# EAGLE design Adafruit 1.54in eInk Breakout with EYESPI (EAGLE 9.6.2)
COMPANY: ADAFRUIT INDUSTRIES; DRAWN: K. TOWNSEND; REV: A
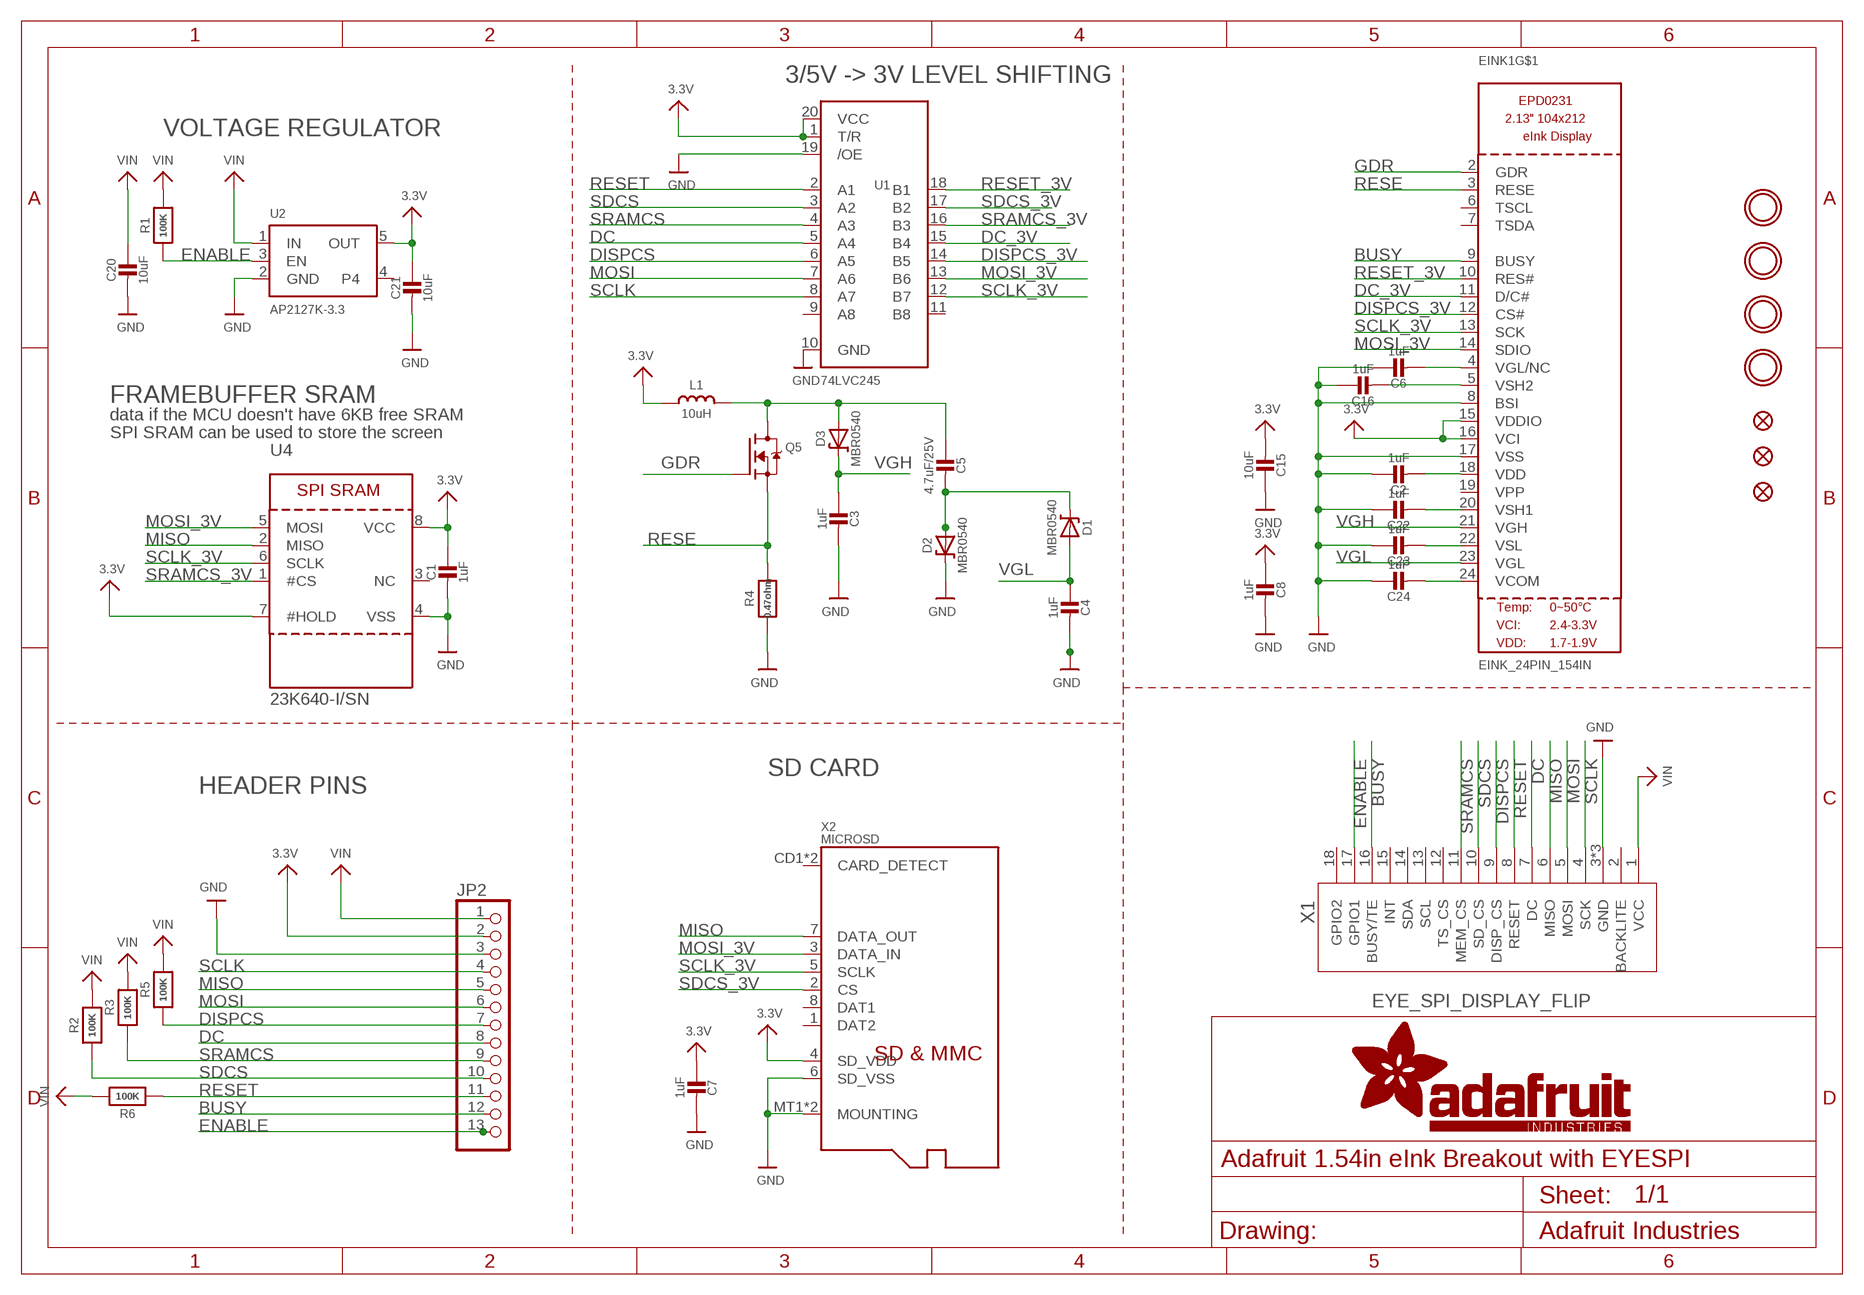
[diagram p0: schematic, sheet 1]

## Parts
C1  1uF  CAP_CERAMIC0805-NOOUTLINE  [0805-NO]
C2  1uF  CAP_CERAMIC0805-NOOUTLINE  [0805-NO]
C3  1uF  CAP_CERAMIC0805-NOOUTLINE  [0805-NO]
C4  1uF  CAP_CERAMIC0805-NOOUTLINE  [0805-NO]
C5  4.7uF/25V  CAP_CERAMIC0805-NOOUTLINE  [0805-NO]
C6  1uF  CAP_CERAMIC0805-NOOUTLINE  [0805-NO]
C7  1uF  CAP_CERAMIC0805-NOOUTLINE  [0805-NO]
C8  1uF  CAP_CERAMIC0805-NOOUTLINE  [0805-NO]
C15  10uF  CAP_CERAMIC0805-NOOUTLINE  [0805-NO]
C16  1uF  CAP_CERAMIC0805-NOOUTLINE  [0805-NO]
C20  10uF  CAP_CERAMIC0805-NOOUTLINE  [0805-NO]
C21  10uF  CAP_CERAMIC0805-NOOUTLINE  [0805-NO]
C22  1uF  CAP_CERAMIC0805-NOOUTLINE  [0805-NO]
C23  1uF  CAP_CERAMIC0805-NOOUTLINE  [0805-NO]
C24  1uF  CAP_CERAMIC0805-NOOUTLINE  [0805-NO]
D1  MBR0540  DIODE-SCHOTTKYSOD-123  [SOD-123]
D2  MBR0540  DIODE-SCHOTTKYSOD-123  [SOD-123]
D3  MBR0540  DIODE-SCHOTTKYSOD-123  [SOD-123]
EINK1  EINK_24PIN_154IN  [EINK_154IN]
FID1  FIDUCIAL_1MM  [FIDUCIAL_1MM]
FID2  FIDUCIAL_1MM  [FIDUCIAL_1MM]
FID3  FIDUCIAL_1MM  [FIDUCIAL_1MM]
JP2  HEADER-1X13  [1X13_ROUND_70]
L1  10uH  INDUCTORNR401  [INDUCTOR_4X4MM_NR401]
Q5  IRLML0100  IRLML2060TRPBF  [SOT23-3]
R1  100K  RESISTOR0805_NOOUTLINE  [0805-NO]
R2  100K  RESISTOR0805_NOOUTLINE  [0805-NO]
R3  100K  RESISTOR0805_NOOUTLINE  [0805-NO]
R4  0.47ohm  RESISTOR0805_10MGAP  [0805_10MGAP]
R5  100K  RESISTOR0805_NOOUTLINE  [0805-NO]
R6  100K  RESISTOR0805_NOOUTLINE  [0805-NO]
U1  74LVC245  74LCX245_TSSOP20  [TSSOP20]
U2  AP2127K-3.3  VREG_SOT23-5  [SOT23-5]
U4  23K640-I/SN  SRAM_SPI_SOIC8  [SOIC8_150MIL]
U$3  MOUNTINGHOLE2.5  [MOUNTINGHOLE_2.5_PLATED]
U$4  MOUNTINGHOLE2.5  [MOUNTINGHOLE_2.5_PLATED]
U$5  MOUNTINGHOLE2.5  [MOUNTINGHOLE_2.5_PLATED]
U$6  MOUNTINGHOLE2.5  [MOUNTINGHOLE_2.5_PLATED]
X1  EYE_SPI_DISPLAY_FLIP  [EYE_SPI_DISPLAY_BOTCONTACT]
X2  MICROSD  [MICROSD]

## Nets
3.3V: C1.1 C7.1 C8.1 C15.2 C21.1 EINK1.15(VDDIO) EINK1.16(VCI) JP2.2 L1.P$2 U1.1(T/R) U1.20(VCC) U2.5(OUT) U4.7(#HOLD) U4.8(VCC) X2.4(SD_VDD)
BUSY: EINK1.9(BUSY) JP2.12 X1.16(BUSY/TE)
DC: JP2.8 U1.5(A4) X1.7(DC)
DC_3V: EINK1.11(D/C#) U1.15(B4)
DISPCS: JP2.7 R5.1 U1.6(A5) X1.9(DISP_CS)
DISPCS_3V: EINK1.12(CS#) U1.14(B5)
ENABLE: JP2.13 R1.1 U2.3(EN) X1.17(GPIO1)
GDR: EINK1.2(GDR) Q5.1(G)
GND: C1.2 C2.1 C3.2 C4.2 C6.1 C7.2 C8.2 C15.1 C16.1 C20.2 C21.2 C22.1 C23.1 C24.1 D2.C EINK1.8(BSI) EINK1.17(VSS) JP2.3 R4.2 U1.10(GND) U1.19(/OE) U2.2(GND) U4.4(VSS) X1.3(GND) X1.SUPPORT1(GND) X1.SUPPORT2(GND) X2.6(SD_VSS) X2.MT1(MOUNTING) X2.MT2(MOUNTING)
MISO: JP2.5 U4.2(MISO) X1.6(MISO) X2.7(DATA_OUT)
MOSI: JP2.6 U1.7(A6) X1.5(MOSI)
MOSI_3V: EINK1.14(SDIO) U1.13(B6) U4.5(MOSI) X2.3(DATA_IN)
N$2: C5.2 D1.C D2.A
N$3: C5.1 D3.A L1.P$1 Q5.3(D)
N$4: C16.2 EINK1.5(VSH2)
N$5: C2.2 EINK1.18(VDD)
N$6: C22.2 EINK1.20(VSH1)
N$9: C6.2 EINK1.4(VGL/NC)
N$27: C23.2 EINK1.22(VSL)
N$33: C24.2 EINK1.24(VCOM)
RESE: EINK1.3(RESE) Q5.2(S) R4.1
RESET: JP2.11 R6.1 U1.2(A1) X1.8(RESET)
RESET_3V: EINK1.10(RES#) U1.18(B1)
SCLK: JP2.4 U1.8(A7) X1.4(SCK)
SCLK_3V: EINK1.13(SCK) U1.12(B7) U4.6(SCLK) X2.5(SCLK)
SDCS: JP2.10 R2.1 U1.3(A2) X1.10(SD_CS)
SDCS_3V: U1.17(B2) X2.2(CS)
SRAMCS: JP2.9 R3.1 U1.4(A3) X1.11(MEM_CS)
SRAMCS_3V: U1.16(B3) U4.1(#CS)
VGH: C3.1 D3.C EINK1.21(VGH)
VGL: C4.1 D1.A EINK1.23(VGL)
VIN: C20.1 JP2.1 R1.2 R2.2 R3.2 R5.2 R6.2 U2.1(IN) X1.1(VCC)
Unconnected: EINK1.6(TSCL) EINK1.7(TSDA) EINK1.19(VPP) EINK1.SPRT1(MT) EINK1.SPRT2(MT) U1.9(A8) U1.11(B8) U2.4 U4.3(NC) X1.2(BACKLITE) X1.12(TS_CS) X1.13(SCL) X1.14(SDA) X1.15(INT) X1.18(GPIO2) X2.1(DAT2) X2.8(DAT1) X2.CD1(CARD_DETECT) X2.CD2(CARD_DETECT)

## Notes on the sheet
- 3/5V -> 3V LEVEL SHIFTING
- VOLTAGE REGULATOR
- FRAMEBUFFER SRAM
- data if the MCU doesn't have 6KB free SRAM
- SPI SRAM can be used to store the screen
- SD CARD
- HEADER PINS

## Library data of the parts
C1-C8 C15 C16 C20-C24 = microbuilder:CAP_CERAMIC: Ceramic Capacitors For new designs, use the packages preceded by an '_' character since they are more reliable: The following footprints should be used on most boards: _0402 - Standard footprint for regular board layouts _0603 - Standard footprint for regular board layouts _0805 - Standard footprint for regular board layouts _1206 - Standard footprint for regular board layouts For extremely tight-pitch boards where space is at a premium, the following 'micro-pitch' footprints can be used (smaller pads, no silkscreen outline, etc.): _0402MP - Micro-pitch footprint for very dense/compact boards _0603MP - Micro-pitch footprint for very dense/compact boards _0805MP - Micro-pitch footprint for very dense/compact boards _1206MP - Micro-pitch footprint for very dense/compact boards
D1-D3 = microbuilder:DIODE-SCHOTTKY
EINK1 = adafruit_display:EINK_24PIN
FID1-FID3 = microbuilder:FIDUCIAL: Fiducial Alignment Points Various fiducial points for machine vision alignment.; BOM: EXCLUDE
JP2 = microbuilder:HEADER-1X13
L1 = microbuilder:INDUCTOR: Inductors 0603: 10nH Ceramic Inductor - microwire antenna/RF (Digikey: 712-1434-2-ND) 0805: 560nH Ceramic Inductor - RF (Digikey: 553-1047-1-ND) 270nH Ceramic Inductor - Q = 40@250MHz, +-5%, 1 Ohm DC Resistance (Digikey: 535-10506-2-ND) 1007 (2518 Metric) SMT: 10µH 10% 250mOhm 820mA 1007 Inductor (Digikey: 587-2189-1-ND) 22µH 10% 500mOhm 580mA 1007 Inductor (Digikey: 587-2190-1-ND) 47µH 10% 950mOhm 420mA 1007 Inductor (Digikey: 587-2191-1-ND) 47µH 5% 100mOhm 1A 1008 Inductor (Digikey: 732-1816-1-ND) 5.0x5.0mm (Taiyo Yuden NR5040 Series) 6.8µH 20% 2.3A 64mOhm Inductor (Digikey: 587-2374-2-ND) 5.0x5.0mm (TDK VLC5045 Series) 4.7µH 20% 3.3A 34mOhm Inductor (Digikey: 445-6526-1-ND) 6.8µH 20% 2.7A 46mOhm Inductor (Digikey: 445-6527-1-ND) 6.0x6.0mm (TDK VLC6045 Series) 4.7µH 20% 3.8A 27mOhm Inductor (Digikey: 445-6538-2-ND) 6.8µH 20% 3A 41mOhm Inductor (Digikey: 445-6540-1-ND) 6.2µH 30% 2.2A 45mOhm Inductor (Digikey: SRR5028-6R2YCT-ND) - Not TDK VLC6045 but footprint should match 6.0x6.0mm (TDK SLF6045 Series) 6.8uH 30% 2A 33mOhm Inductor (Digikey: 445-4572-1-ND, Mouser: 810-SLF645T6R8N2R0PF) 6.0x6.0mm (Sumida CDRH5D28 Series) 6.2uH 30% 1.8A 45mOhm Inductor (Digikey: 308-1542-1-ND) Taiyo Yuden NR3015T2R2M - 2.2uH 20% 1.5A (Digikey: 587-1648-2-ND, Mouser: 963-NR3015T2R2M) - Used with TI TPS62172 CoilCraft RFID Transponder Coil - MA5532-AE (For use with AS3935 Lightning Sensor) Taiyo Yuden NRH2412T2R2MNGH - 2.2uH 20% 1AA (Digikey: 587-3443-1-ND) - Used with TI LM3671 Vishay IHLP 1.0uH Molded Inductor - 24mOhm DCR, 5A, +/-20%, -55°C-125°C (Digikey: 541-1319-1-ND)
Q5 = Parts:IRLML2060TRPBF
R1-R6 = microbuilder:RESISTOR: Resistors For new designs, use the packages preceded by an '_' character since they are more reliable: The following footprints should be used on most boards: _0402 - Standard footprint for regular board layouts _0603 - Standard footprint for regular board layouts _0805 - Standard footprint for regular board layouts _1206 - Standard footprint for regular board layouts For extremely tight-pitch boards where space is at a premium, the following 'micro-pitch' footprints can be used (smaller pads, no silkscreen outline, etc.): _0402MP - Micro-pitch footprint for very dense/compact boards _0603MP - Micro-pitch footprint for very dense/compact boards _0805MP - Micro-pitch footprint for very dense/compact boards _1206MP - Micro-pitch footprint for very dense/compact boards
U1 = microbuilder:74LCX245: 74LCX245MTC - 5.0V Tolerant Bi-Directional Buffer Can be used to interface 5.0V logic to 2.5 or 3.3V devices Digikey: 74LCX245MTCXTR-ND Mouser: 512-74LCX245MTCX
U2 = adafruit_power:VREG_SOT23-5: SOT23-5 Fixed Voltage Regulators Part Current Out V Out V In V Dropout θJA (°C/W) TJ (°C) Digikey Part No. ADP121 150mA 3.3V 3.4-5.5V 0.09V @ 150mA -- -- ADP121-AUJZ33R7CT-ND ADP121 150mA 3.0V 3.1-5.5V 0.09V @ 150mA -- -- ADP121-AUJZ30R7CT-ND ADP122 300mA 3.3V 3.4-5.5V 0.085V @ 300mA -- -- ADP122AUJZ-3.3-R7CT-ND ADP1712 300mA 3.3V 3.5-5.5V 0.17V @ 300mA -- -- ADP1712AUJZ-3.3-R7TR-ND AP7311 (Low Cost) 150mA 3.3V 3.5-6V 0.15V @ 150mA -- -- AP7311-33WG-7DICT-ND LD39015M18R 150mA 1.8V 1.9V-5.5V 0.08V @ 100mA -- -- 497-6977-1-ND LP2985A-33DBVR 150mA 3.3V 3.3-16V 0.28V @ 150mA 206 150 296-18479-1-ND MCP1824T-3302E/OT 300mA 3.3V 3.5V-6V 0.2V @ 300mA -- -- MCP1824T-3302E/OTCT-ND MIC5205-2.5YM5 TR 150mA 2.5V 2.7-16V 0.165V @ 150mA -- -- 576-1257-2-ND MIC5205-3.0YM5 TR 150mA 3.0V 3.2V-16V 0.165V @ 150mA -- -- 576-1258-2-ND MIC5205-3.3YM5 TR 150mA 3.3V 3.5V-16V 0.165V @ 150mA -- -- 576-1259-2-ND TPS780330220 150mA 3.3V+2.2V 3.6-5.5V 250mV Max -- -- 296-23332-1-ND TDA3663/N1,135 100mA 3.3V 3.5-45V 0.18V @ 50mA -- -- 568-5343-1-ND Max operating temp can be calculated using θJA, TJ (max junction temperature), and power in watts. Set the "Maximum Ambient Temperature" until it reaches TJ ("Max Junction Temperature"), which is the absolute limit for safe use of the regulator: Heat Sink Temperature Calculator <http://www.daycounter.com/Calculators/Heat-Sink-Temperature-Calculator.phtml> For example, With 12V source into a 3.3V LP2985 and a 30mA load, we are dissipating (12V-3.3V) * 0.03A = 0.261W. With a θJA of 206 °C/W, a TJ of 150°C, and 261mW we can safely use the chip without a heat sink up to 75°C (=147.1°C Junction Temperature).; JLC_ROTATION: 270
U4 = microbuilder:SRAM_SPI_SOIC8: SRAM - 8-Pin SPI Interface 23K640-I/SN - 8KB (64Kb), 20MHz, 2.7-3.6V 23K256-I/SN - 32KB (256Kb), 20MHz, 2.7-3.6V 23LC512-I/SN - 64KB (512Kb), 20MHz, 2.7-3.6V
U$3-U$6 = adafruit_electromech:MOUNTINGHOLE: Mounting Hole For #2 screws (0.086"/2.18mm width, 0.094"/2.4mm hole) use 2.5mm; BOM: EXCLUDE
X1 = adafruit_display:EYE_SPI_DISPLAY; LCSC: C2856802
X2 = adafruit_electromech:MICROSD: MicroSD/Transflash Card Holder with SPI pinout 3M: 2908-05WB-MG 4UConnector: 19656 Footprint courtesy: Adafruit Industries; JLC_ROTATION: 90; LCSC: C125617

## Board
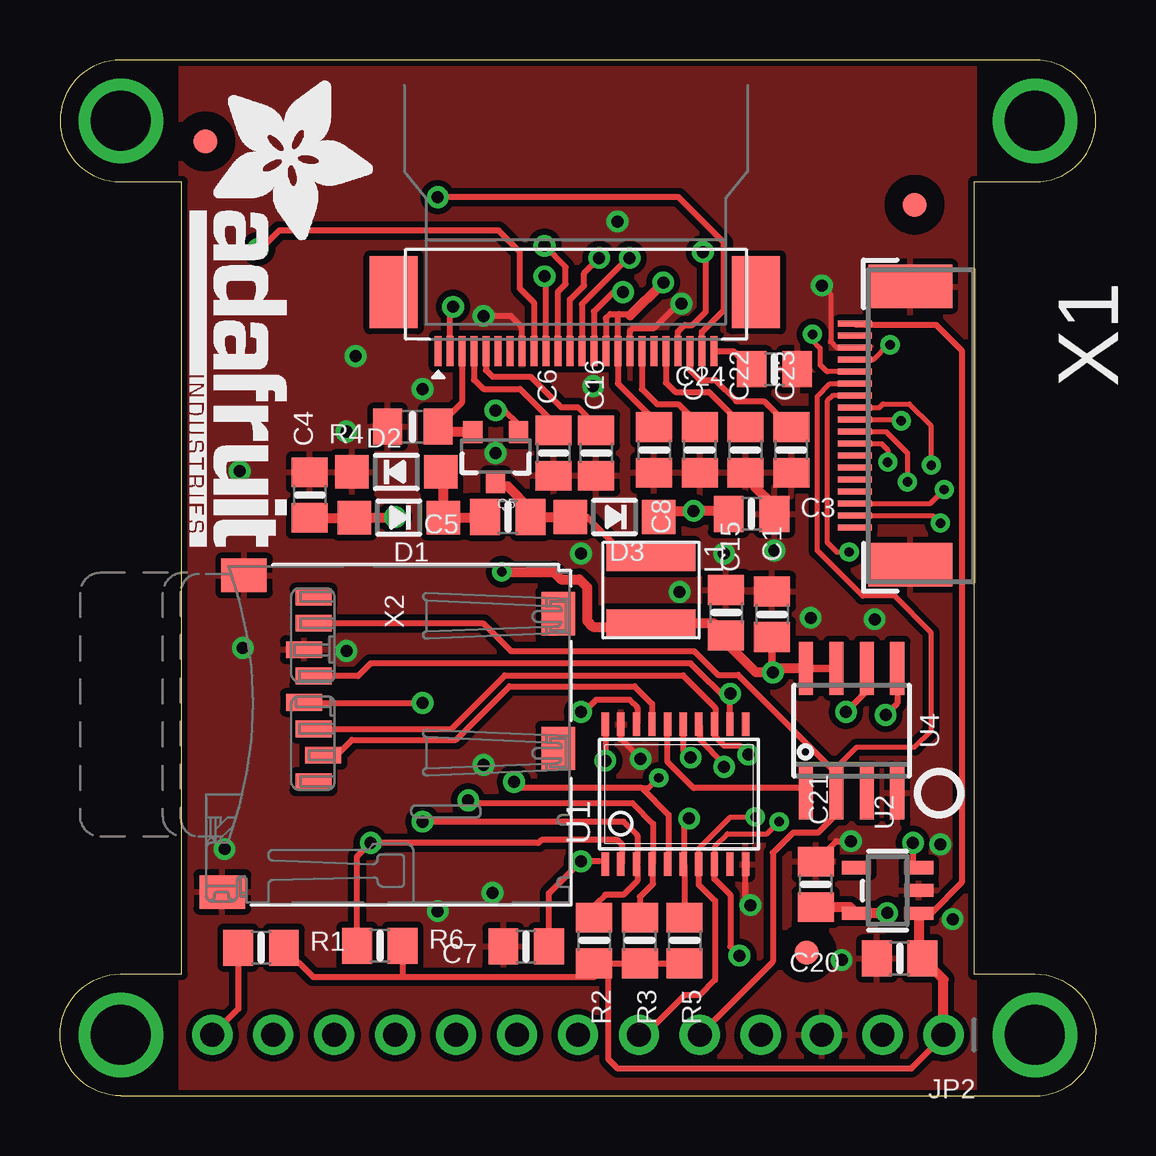
[diagram p1: board, top side]
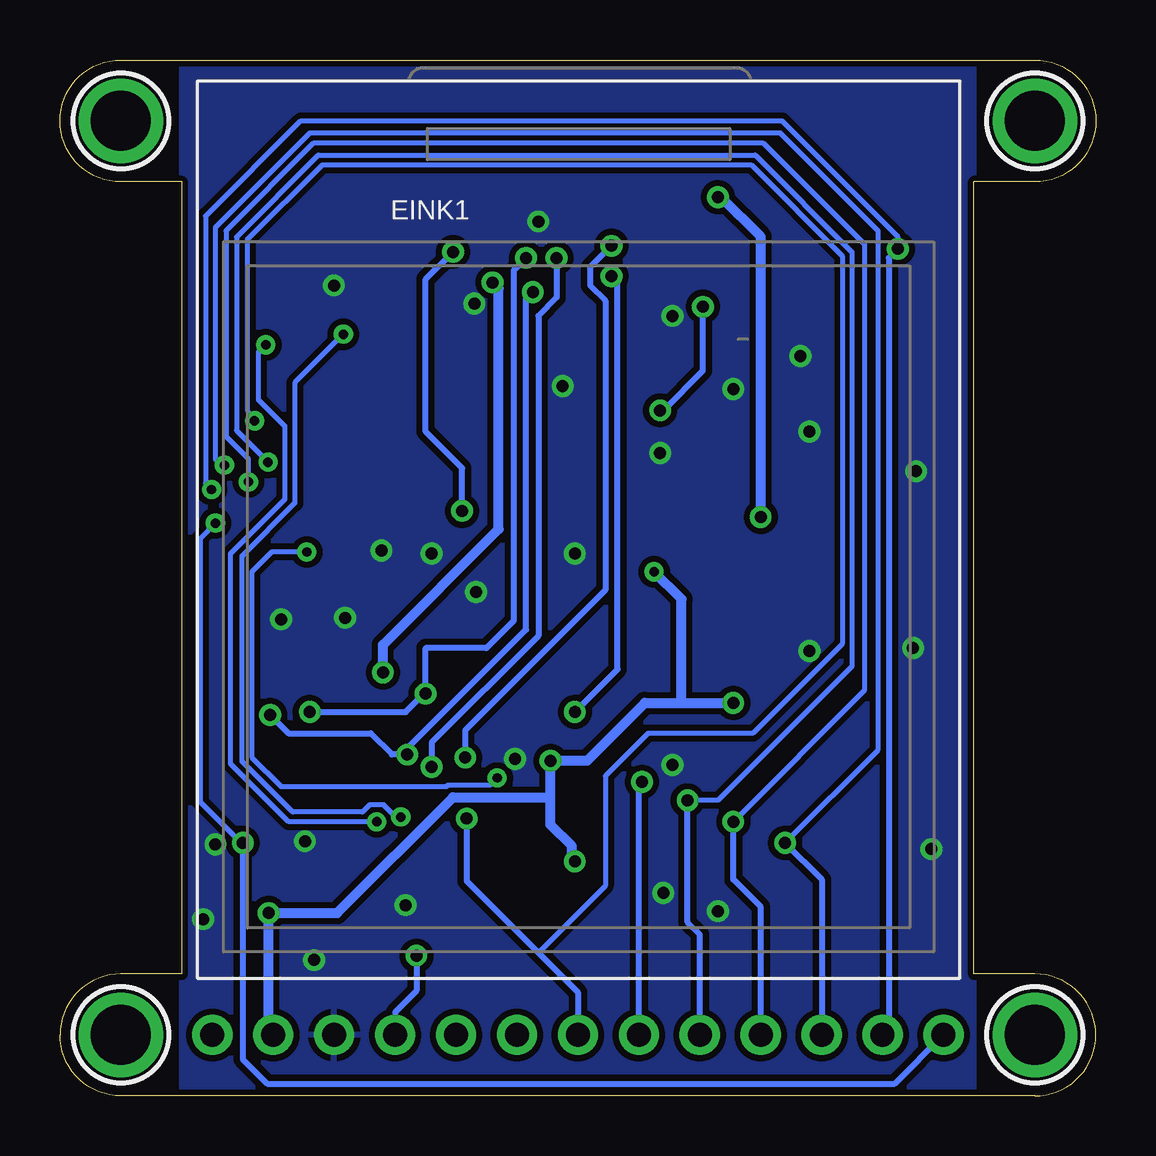
[diagram p2: board, bottom side, seen from below]

Size 43.18 x 43.18 mm. Coordinates in mm from the lower left corner, seen from the top.
Outline: 2.54,0 40.64,0 arc90 43.18,2.54 arc90 40.64,5.08 38.1,5.08 38.1,38.1 40.64,38.1 arc90 43.18,40.64 arc90 40.64,43.18 2.54,43.18 arc90 0,40.64 arc90 2.54,38.1 5.08,38.1 5.08,5.08 2.54,5.08 arc90 0,2.54 arc90 2.54,0
Copper layers (1*16): Top 0.035mm / dielectric 1.5mm / Bottom 0.035mm
Design rules "adafruit *": minimum track width 8mil, minimum drill 15.5mil, track to track 8mil, track to pad 8mil, pad to pad 8mil, via to via 8mil, smd to smd 8mil, copper to edge 10mil, drill to drill 8mil, minimum pad ring 10mil, minimum via ring 8mil, stop-mask expansion 2mil, vias tented up to drill 20mil, thermal gap 10mil

### Footprints (pad centres in the part's own frame; a part is rotated, then mirrored left to right if it is on the bottom)
0805-NO = smd 1.24 x 1.5: 1 -0.95,0; 2 0.95,0
SOD-123 = smd 1.4 x 1.4: A 1.85,0; C -1.85,0
EINK_154IN = smd 0.275 x 1.25 bottom: 1 5.75,-1.05; 2 5.25,-1.05; 3 4.75,-1.05; 4 4.25,-1.05; 5 3.75,-1.05; 6 3.25,-1.05; 7 2.75,-1.05; 8 2.25,-1.05; 9 1.75,-1.05; 10 1.25,-1.05; 11 0.75,-1.05; 12 0.25,-1.05; 13 -0.25,-1.05; 14 -0.75,-1.05; 15 -1.25,-1.05; 16 -1.75,-1.05; 17 -2.25,-1.05; 18 -2.75,-1.05; 19 -3.25,-1.05; 20 -3.75,-1.05; 21 -4.25,-1.05; 22 -4.75,-1.05; 23 -5.25,-1.05; 24 -5.75,-1.05 | smd 2 x 3 bottom: SPRT1 7.6,1.41; SPRT2 -7.51,1.41
FIDUCIAL_1MM = smd 1 x 1: 1 0,0
1X13_ROUND_70 = drill 1 pad 1.676: 1 -15.24,0; 2 -12.7,0; 3 -10.16,0; 4 -7.62,0; 5 -5.08,0; 6 -2.54,0; 7 0,0; 8 2.54,0; 9 5.08,0; 10 7.62,0; 11 10.16,0; 12 12.7,0; 13 15.24,0
INDUCTOR_4X4MM_NR401 = smd 1.2 x 3.7: P$1 -1.4,0; P$2 1.4,0
SOT23-3 = smd 0.8 x 0.9: 1 -0.95,-1; 2 0.95,-1; 3 0,1.1
0805_10MGAP = smd 1.2 x 1.5: 1 -1.05,0; 2 1.05,0
TSSOP20 = smd 0.305 x 0.991: 1 -2.925,-2.918; 2 -2.275,-2.918; 3 -1.625,-2.918; 4 -0.975,-2.918; 5 -0.325,-2.918; 6 0.325,-2.918; 7 0.975,-2.918; 8 1.625,-2.918; 9 2.275,-2.918; 10 2.925,-2.918; 11 2.925,2.918; 12 2.275,2.918; 13 1.625,2.918; 14 0.975,2.918; 15 0.325,2.918; 16 -0.325,2.918; 17 -0.975,2.918; 18 -1.625,2.918; 19 -2.275,2.918; 20 -2.925,2.918
SOT23-5 = smd 0.55 x 1.2: 1 -0.95,-1.3; 2 0,-1.3; 3 0.95,-1.3; 4 0.95,1.3; 5 -0.95,1.3
SOIC8_150MIL = smd 0.6 x 2.2: 1 -1.905,-2.6; 2 -0.635,-2.6; 3 0.635,-2.6; 4 1.905,-2.6; 5 1.905,2.6; 6 0.635,2.6; 7 -0.635,2.6; 8 -1.905,2.6
MOUNTINGHOLE_2.5_PLATED = drill 2.5 pad 3.2: P$1 0,0
EYE_SPI_DISPLAY_BOTCONTACT = smd 0.25 x 1.4: 1 4.25,1.154; 2 3.75,1.154; 3 3.25,1.154; 4 2.75,1.154; 5 2.25,1.154; 6 1.75,1.154; 7 1.25,1.154; 8 0.75,1.154; 9 0.25,1.154; 10 -0.25,1.154; 11 -0.75,1.154; 12 -1.25,1.154; 13 -1.75,1.154; 14 -2.25,1.154; 15 -2.75,1.154; 16 -3.25,1.154; 17 -3.75,1.154; 18 -4.25,1.154 | smd 1.8 x 3.5: SUPPORT1 -5.8,-1.152; SUPPORT2 5.8,-1.152
MICROSD = smd 0.7 x 1.5: 1 1.761,-3.147; 2 0.661,-2.747; 3 -0.439,-3.147; 4 -1.539,-3.547; 5 -2.639,-3.147; 6 -3.739,-3.547; 7 -4.839,-3.147; 8 -5.939,-3.147 | smd 1.8 x 1.4: CD1 -5.239,7.053; CD2 0.38,7.053 | smd 1.4 x 1.9: MT1 -6.839,-6.047; MT2 6.361,-6.947

### Placement (x,y rotation side)
C1  29.68,20.08 90 top
C2  26.67,26.92 90 top
C3  28.83,24.26 0 top
C4  10.41,25.04 90 top
C5  18.67,24.13 180 top
C6  20.57,26.8 90 top
C7  19.43,6.22 180 top
C8  24.77,26.92 270 top
C15  27.77,20.14 270 top
C16  22.35,26.8 90 top
C20  35,5.73 180 top
C21  31.51,8.81 90 top
C22  28.58,26.92 90 top
C23  30.48,26.92 90 top
C24  29.78,30.29 180 top
D1  14.12,24.1 180 top
D2  14.02,26.01 0 top
D3  23.11,24.13 180 top
EINK1  21.51,32.09 0 bottom
FID1  6.06,39.78 0 top
FID2  31.12,5.98 90 top
FID3  35.62,37.15 0 top
JP2  21.59,2.54 180 top
L1  24.64,21.08 270 top
PLABEL0  [PLABEL0]  36.83,4.19 0 top
PLABEL1  [PLABEL1]  19.05,0.89 0 top
PLABEL2  [PLABEL2]  31.75,4.19 0 top
PLABEL3  [PLABEL3]  24.13,0.89 0 top
PLABEL4  [PLABEL4]  26.67,4.19 0 top
PLABEL5  [PLABEL5]  29.21,0.89 0 top
PLABEL6  [PLABEL6]  21.59,4.19 0 top
PLABEL7  [PLABEL7]  16.51,4.19 0 top
PLABEL8  [PLABEL8]  11.43,4.19 0 top
PLABEL9  [PLABEL9]  8.89,0.89 0 top
PLABEL10  [PLABEL10]  13.97,0.89 0 top
PLABEL11  [PLABEL11]  34.29,0.89 0 top
PLABEL12  [PLABEL12]  6.35,4.19 0 top
PLABEL13  [PLABEL13]  13.34,42.86 0 top
PLABEL14  [PLABEL14]  16.26,36.07 0 top
PLABEL15  [PLABEL15]  36.83,4.19 0 bottom
PLABEL16  [PLABEL16]  34.29,0.89 0 bottom
PLABEL17  [PLABEL17]  31.75,4.19 0 bottom
PLABEL18  [PLABEL18]  24.13,0.89 0 bottom
PLABEL19  [PLABEL19]  26.67,4.19 0 bottom
PLABEL20  [PLABEL20]  29.21,0.89 0 bottom
PLABEL21  [PLABEL21]  21.59,4.19 0 bottom
PLABEL22  [PLABEL22]  16.51,4.19 0 bottom
PLABEL23  [PLABEL23]  11.43,4.19 0 bottom
PLABEL24  [PLABEL24]  8.89,0.89 0 bottom
PLABEL25  [PLABEL25]  13.97,0.89 0 bottom
PLABEL26  [PLABEL26]  19.05,0.89 0 bottom
PLABEL27  [PLABEL27]  6.35,4.19 0 bottom
Q5  18.16,26.67 180 top
R1  8.38,6.18 0 top
R2  22.27,6.48 270 top
R3  24.17,6.48 270 top
R4  14.71,27.89 180 top
R5  26.03,6.48 270 top
R6  13.34,6.26 0 top
U1  25.65,12.57 0 top
U2  34.5,8.56 90 top
U4  33,15.22 0 top
U$3  40.64,2.54 0 bottom
U$4  2.54,2.54 0 bottom
U$5  40.64,40.64 0 bottom
U$6  2.54,40.64 0 bottom
U$9  [PCBFEAT-REV-040]  36.65,12.63 0 top
U$28  [ADAFRUIT_TEXT_20MM]  5.42,42.47 270 top
X1  34.29,27.94 90 top
X2  13.72,14.86 270 top

### Tracks (layer width: path | path; a pad name or v marks a point on that pad's centre or on a via)
3.3V  (via drill 0.39, 0.5)
  Top 0.203: U1.1 22.6,9.78 22.48,9.78
  Top 0.254: EINK1.15 22.76,32.41 22.94,32.59 23.3,32.59 | 22.48,9.78 v21.72,9.78 20.38,8.44 C7.1 | v15.11,16.38 10.67,16.38 10.65,16.4 X2.4 | C8.1 24.77,28.19 23.26,29.7 EINK1.16 23.26,32.55 23.3,32.59 | U1.20 v22.73,13.97 | 23.3,32.59 23.7,32.59 23.77,32.53
  Top 0.305: U4.8 U4.7 29.68,17.82 C1.1
  Top 0.406: C21.1 32.94,7.87 U2.5 v34.48,7.62 | U4.8 29.76,17.82 29.59,17.65 v29.72,17.65 29.02,17.65 27.77,18.91 C15.2 27.27,19.68 L1.P$2 24.13,19.68 24,19.55 22.23,19.55 21.97,19.81 21.97,21.21 21.65,21.53 20.89,21.53 20.57,21.84 v18.41,21.84 | 23.77,32.53 v25.15,33.91
  Bottom 0.406: v29.72,17.65 29.72,18.8 24.89,23.62 24.89,33.66 v25.15,33.91 | 17.27,16.38 18.8,16.38 21.21,13.97 v22.73,13.97 22.73,12.45 | 17.27,16.38 v15.11,16.38 | 22.73,12.45 22.73,11.3 21.84,10.41 21.84,9.91 v21.72,9.78 | JP2.2 34.48,2.73 v34.48,7.62 31.62,7.62 26.8,12.45 22.73,12.45 | 17.27,16.38 17.27,20.7 v18.41,21.84
BUSY  (via drill 0.39, 0.5)
  Top 0.203: X1.16 36.28,24.69 v36.86,25.27
  Top 0.254: EINK1.9 19.76,33.07 19.18,33.66 19.18,35.18 18.29,36.07 9.14,36.07 8.38,35.31 v8.25,35.31
  Bottom 0.203: v36.86,25.27 37.12,25.53 37.12,36.67 33.15,40.64 13.08,40.64 8.25,35.81 v8.25,35.31
  Bottom 0.254: v8.25,35.31 8.64,34.92 8.64,2.79 JP2.12
DC  (via drill 0.39, 0.5)
  Top 0.203: X1.7 32.21,29.19 31.98,28.96 31.98,23.08 32.38,22.67 v32.89,22.67 | v24.96,13.25 24.53,12.83 24.26,12.83
  Top 0.254: v18.92,13.08 19.18,12.83 24.26,12.83 25.37,11.71 25.37,9.7 U1.5
  Bottom 0.203: v32.89,22.67 34.36,22.67 35.18,21.84 35.18,14.11 33.97,12.89 27.07,12.89 27.01,12.95 25.26,12.95 v24.96,13.25
  Bottom 0.254: JP2.8 19.05,12.95 v18.92,13.08
DC_3V  (via drill 0.5)
  Top 0.254: EINK1.11 20.76,33.52 21.08,33.85 21.08,34.54 v20.19,35.43 | U1.15 25.98,14.41 v26.29,14.1
  Bottom 0.254: v20.19,35.43 21.08,34.54 21.08,33.78 20.45,33.15 20.45,21.08 26.29,15.24 v26.29,14.1
DISPCS  (via drill 0.39, 0.5)
  Top 0.203: X1.9 35.02,28.19 v35.07,28.14
  Top 0.254: v26.23,11.56 26.02,11.35 26.02,9.7 U1.6 26.03,9.6 R5.1
  Bottom 0.203: 23.24,5.97 20.45,8.76 20.45,13.34 18.67,15.11 14.29,15.11 10.57,18.84 10.57,35.01 14.37,38.81 32.24,38.81 35.37,35.68 35.37,28.57 35.07,28.27 v35.07,28.14
  Bottom 0.254: v26.23,11.56 26.23,8.95 23.24,5.97 21.59,4.32 JP2.7
DISPCS_3V  (via drill 0.5)
  Top 0.254: v27.69,13.72 27.69,13.84 26.67,14.86 26.67,15.45 U1.14 | EINK1.12 21.26,33.2 21.84,33.78 21.84,34.29 v22.48,34.92
  Bottom 0.254: v27.69,13.72 27.69,14.73 23.24,19.18 23.24,32.51 22.48,33.27 v22.48,34.92
ENABLE  (via drill 0.39, 0.5)
  Top 0.203: X1.17 36.39,24.19 v36.7,23.88
  Top 0.254: v35.56,10.54 35.56,9.75 U2.3 | R1.1 7.43,3.62 JP2.13
  Bottom 0.203: v36.7,23.88 37.34,23.24 37.34,12.26 35.62,10.54 v35.56,10.54
  Bottom 0.254: v35.56,10.54 35.56,1.52 34.54,0.51 8.38,0.51 JP2.13
GDR  (via drill 0.5)
  Top 0.254: v16.38,32.89 16.26,32.77 EINK1.2 | Q5.1 19.11,28 18.54,28.57 v18.16,28.57
  Bottom 0.254: v16.38,32.89 16.38,30.23 18.03,28.57 v18.16,28.57
GND  (via drill 0.5)
  Top 0.203: X1.3 32.37,31.19 32.13,31.43 32.13,33.41 v31.76,33.78
  Top 0.254: EINK1.17 23.76,31.89 23.88,32 24.77,32 25.78,33.02 v25.91,33.02 | EINK1.8 19.26,32.05 18.8,32.51 v17.65,32.51 | v28.78,7.95 28.58,8.15 U1.10 | v24.21,14.05 23.38,14.87 U1.19 | C21.2 32.36,10.62 v32.97,10.62
  Top 0.406: C3.2 29.78,24.58 28.96,25.4
  other vias: 7.62,18.67 29.78,22.73 23.24,36.45 17.65,13.79 6.86,10.29 12.32,30.84 33.96,19.86 37.21,7.37 31.29,19.93 22.23,29.59 11.94,27.69 7.49,26.04 15.11,29.46 21.72,22.61 32.59,5.66 11.94,18.54 15.75,7.7 18.03,8.46 18.16,26.8 25.83,21.01 36.7,10.48 27.69,22.61
  pour Top (isolate 0.254): 5.08,43.18 38.1,43.18 38.1,0.13 5.08,0.13
  pour Bottom (isolate 0.254): 5.08,43.18 38.1,43.18 38.1,0 5.08,0
MISO
  Top 0.203: 32.36,13.55 32.36,13.7 33.21,14.54 35.62,14.54 36.32,15.24 36.32,19.3 34.8,20.83 33.46,20.83 31.57,22.72 31.57,29.16 32.1,29.69 X1.6
  Top 0.254: JP2.5 29.72,5.59 29.72,10.13 30.56,10.97 31.6,10.97 32.36,11.73 U4.2 32.36,13.55 32.27,13.55 28.26,17.55 27.42,17.55 26.43,18.54 18.8,18.54 17.65,19.68 11.3,19.68 11.29,19.7 X2.7
MOSI  (via drill 0.39)
  Top 0.203: U1.7 26.63,10.31 27.94,11.63 v28.98,11.63 | X1.5 31.98,30.19 31.69,30.48 31.69,31.18 31.37,31.5 v31.37,31.75
  Top 0.254: JP2.6 24.38,2.54 26.03,4.19 26.67,4.19 27.3,4.83 27.3,8.13 26.63,8.8 U1.7
  Bottom 0.203: v28.98,11.63 29.19,11.63 29.69,12.13 30.27,12.13 30.57,11.83 33.48,11.83 35.59,13.94 35.59,22.51 33.4,24.7 33.4,29.72 v31.37,31.75
MOSI_3V  (via drill 0.5)
  Top 0.254: v28.7,14.22 28.32,14.61 27.69,14.61 27.32,14.97 27.32,15.45 | EINK1.14 22.26,32.69 23.07,33.5 v23.47,33.5 | U4.5 34.9,16.36 v34.42,15.88 | U1.13 27.32,15.45 | X2.3 16.31,15.3 18.54,17.53 25.97,17.53 27.32,16.18 27.32,15.45
  Bottom 0.254: v34.42,15.88 33.66,15.11 30.23,15.11 29.34,14.22 v28.7,14.22 28.7,14.48 23.75,19.43 23.75,33.22 v23.47,33.5
N$2
  Top 0.406: D2.A 15.97,26.01 D1.C 17.72,24.11 C5.2
N$3
  Top 0.254: D3.A 21.97,24.13 23.37,22.73 24.39,22.73 L1.P$1
  Top 0.406: D3.A C5.1 19.62,24.45 18.67,25.4 18.33,25.4 Q5.3
N$4
  Top 0.254: EINK1.5 17.76,30.25 18.03,29.97 19.62,29.97 20.89,28.7 21.59,28.7 22.35,27.94 C16.2
N$5
  Top 0.254: EINK1.18 24.26,29.45 24.26,29.46 24.89,28.83 25.78,28.83 26.67,27.94 C2.2
N$6
  Top 0.254: EINK1.20 25.26,29.73 25.65,29.34 27.05,29.34 28.47,27.92 arc45 C22.2
N$9
  Top 0.254: EINK1.4 17.26,29.86 17.65,29.46 19.18,29.46 20.57,28.07 C6.2
N$27
  Top 0.254: EINK1.22 26.26,30.25 26.67,29.84 27.3,29.84 28.19,28.96 29.34,28.96 30.48,27.81 C23.2
N$33
  Top 0.254: EINK1.24 28.08,31.04 C24.2
RESE
  Top 0.254: EINK1.3 16.76,28.89 15.79,27.92
  Top 0.406: 15.79,27.92 R4.1 15.98,27.67 Q5.2
RESET  (via drill 0.39, 0.5)
  Top 0.203: v36.32,26.29 36.32,27.94 35.42,28.85 34.31,28.85 34.15,28.69 X1.8
  Top 0.254: R6.1 12.38,9.97 v12.95,10.54 19.94,10.54 20.07,10.67 23.24,10.67 23.42,10.49 23.42,9.7 U1.2
  Bottom 0.203: v12.95,10.54 9.07,14.43 9.07,36.05 13.15,40.13 32.77,40.13 36.7,36.2 36.7,26.54 36.45,26.29 v36.32,26.29
  Bottom 0.254: v12.95,10.54 11.43,9.02 JP2.11
RESET_3V  (via drill 0.5)
  Top 0.254: v20.19,34.16 20.16,34.13 20.26,34.03 EINK1.10 | v21.72,16 21.84,16 22.35,16.51 23.75,16.51 24.07,16.19 24.07,15.53 U1.18
  Bottom 0.254: v21.72,16 19.94,17.78 19.94,33.91 v20.19,34.16
SCLK  (via drill 0.39, 0.5)
  Top 0.203: U1.8 27.3,9.68 27.3,10.41 27.81,10.92 29.48,10.92 v29.98,11.42 | v34.6,31.3 34.51,31.3 33.9,30.69 X1.4
  Top 0.254: v28.32,5.84 27.94,6.22 27.94,8.38 27.28,9.04 U1.8
  Bottom 0.203: v29.98,11.42 33.65,11.42 36.07,13.84 36.07,22.61 33.8,24.87 33.8,27.9 34.92,29.02 34.92,30.99 v34.6,31.3
  Bottom 0.254: v28.32,5.84 28.32,4.38 29.21,3.49 JP2.4
SCLK_3V  (via drill 0.5)
  Top 0.254: 27.93,16.39 26.29,18.03 12.95,18.03 12.42,17.5 X2.5 | v23.75,34.92 23.69,34.92 21.76,33 EINK1.13 | v32.77,16 33.63,16.87 U4.6 | U1.12 27.93,16.39 | v27.94,16.76 27.94,16.41 27.93,16.39
  Bottom 0.254: v32.77,16 28.77,16 28,16.76 v27.94,16.76 27.94,18.67 25.4,18.67 24.26,19.81 24.26,34.42 v23.75,34.92
SDCS  (via drill 0.39, 0.5)
  Top 0.203: v35.33,25.59 35.33,26.8 34.43,27.69 X1.10
  Top 0.254: v15.11,11.43 23.49,11.43 24.07,10.85 24.07,9.7 U1.3 24.07,9.61 24.07,8.96 23.49,8.38 22.73,8.38 22.35,8 22.35,7.51 R2.1
  Bottom 0.203: v35.33,25.59 35.33,26.54 36.26,27.48 36.26,36.06 32.6,39.73 13.88,39.73 9.65,35.49 9.65,16.89 v15.11,11.43
  Bottom 0.254: JP2.10 13.97,7.87 15.11,9.02 v15.11,11.43
SDCS_3V
  Top 0.254: X2.2 11.53,14.2 12.17,14.84 16.5,14.84 18.73,17.07 23.95,17.07 24.68,16.34 U1.17
SRAMCS  (via drill 0.39, 0.5)
  Top 0.203: X1.11 34.24,27.19 34.51,26.92 v34.51,26.42
  Top 0.254: v17.02,12.32 17.14,12.19 23.88,12.19 24.72,11.35 24.72,9.7 | R3.1 24.17,8.29 24.72,8.85 24.72,9.7 | 24.72,9.7 U1.4
  Bottom 0.203: v34.51,26.42 35.83,27.73 35.83,35.8 32.41,39.22 14.2,39.22 10.16,35.18 10.16,17.91 15.75,12.32 v17.02,12.32
  Bottom 0.254: JP2.9 16.51,6.73 17.02,7.24 v17.02,12.32
SRAMCS_3V
  Top 0.254: U4.1 31.03,12.62 30.82,12.83 26.42,12.83 25.33,13.91 U1.16
VGH  (via drill 0.5)
  Top 0.254: v26.8,35.18 26.8,34.92 26.92,34.8 26.92,32.69 26.37,32.13 26.03,32.13 25.76,31.86 EINK1.21
  Top 0.406: C3.1 27.69,24.26 27.56,24.38 v26.42,24.38 25.53,24.38 25.27,24.13 D3.C
  Bottom 0.254: v26.42,24.38 26.42,26.16 27.94,27.69 27.94,34.04 v26.8,35.18
VGL  (via drill 0.5)
  Top 0.254: v15.75,37.47 25.78,37.47 27.68,35.57 27.68,32.76 26.76,31.84 EINK1.23
  Top 0.406: C4.1 D1.A 13.95,24.11 v13.97,24.13
  Bottom 0.254: v15.75,37.47 15.62,37.47
  Bottom 0.406: v13.97,24.13 13.97,35.81 15.62,37.47
VIN
  Top 0.254: 22.99,5.53 R2.2 22.27,4.95 14.29,4.95 | 22.99,5.53 R3.2 R5.2 | R1.2 10.55,4.95 14.29,4.95 | JP2.1 36.83,2.48 35.5,1.14 23.24,1.14 22.86,1.52 22.86,5.4 22.99,5.53 | R6.2 14.29,4.95 | X1.1 33.18,32.15 36.51,32.15 37.59,31.07 37.59,8.89 36.31,7.61 U2.1
  Top 0.406: U2.1 35.8,5.88 C20.1 36.83,4.85 JP2.1

### Text on the board
Pinguin_tBackup: 1.54" eInk Display / w/SRAM & uSD | Vin/Vlogic:3-5V | ENA | RST | SRCS | ECS | MISO | GND | VIN | BUSY | SDCS | D/C | MOSI | SCK | 3V3
Pinguin_bBackup: ENA | RST | SRCS | ECS | MISO | GND | VIN | BUSY | SDCS | D/C | MOSI | SCK | 3V3